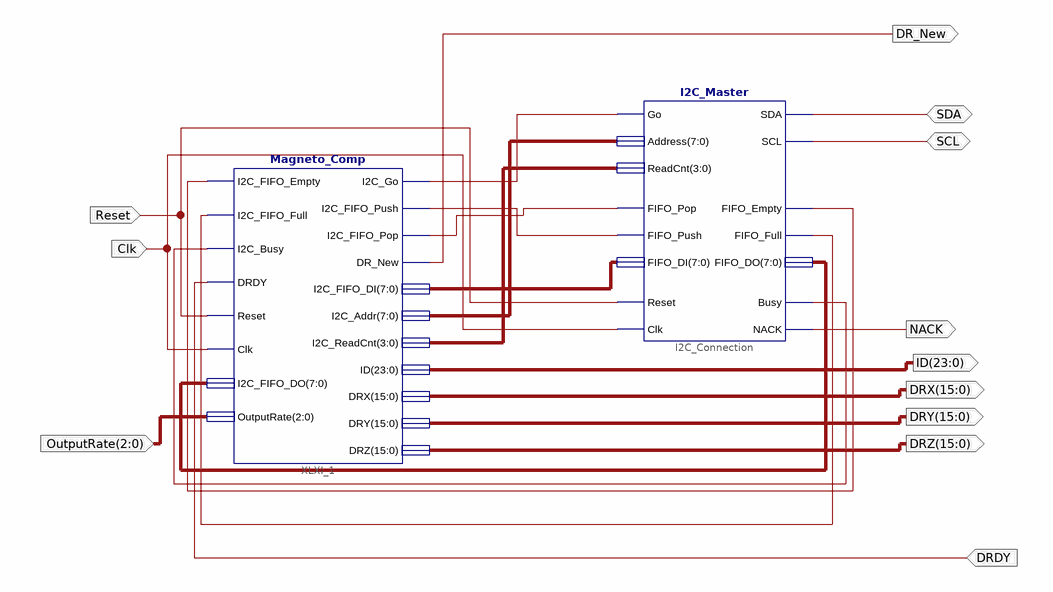
[diagram p0: schematic sheet 1]
// Xilinx ISE schematic MagnetoHMC5883L.sch (aspartan6) as structural Verilog: 2 symbols, 12 ports
module MagnetoHMC5883L (
  input  [2:0] OutputRate,
  input  Clk,
  input  DRDY,
  input  Reset,
  inout  SDA,
  inout  SCL,
  output DR_New,
  output [23:0] ID,
  output [15:0] DRX,
  output [15:0] DRY,
  output [15:0] DRZ,
  output NACK
);

  wire XLXN_4, XLXN_5, XLXN_6, XLXN_52, XLXN_54, XLXN_55;
  wire [3:0] XLXN_29;
  wire [7:0] XLXN_27, XLXN_28, XLXN_198;

  I2C_Master I2C_Connection (
    .Go(XLXN_4), .Address(XLXN_28), .ReadCnt(XLXN_29), .SDA(SDA), .SCL(SCL), .FIFO_Pop(XLXN_6),
    .FIFO_Push(XLXN_5), .FIFO_DI(XLXN_27), .FIFO_Empty(XLXN_52), .FIFO_Full(XLXN_54), .FIFO_DO(XLXN_198),
    .Reset(Reset), .Clk(Clk), .Busy(XLXN_55), .NACK(NACK));
  Magneto_Comp XLXI_1 (
    .I2C_FIFO_Empty(XLXN_52), .I2C_FIFO_Full(XLXN_54), .I2C_Busy(XLXN_55), .DRDY(DRDY), .Reset(Reset),
    .Clk(Clk), .I2C_FIFO_DO(XLXN_198), .OutputRate(OutputRate), .I2C_Go(XLXN_4), .I2C_FIFO_Push(XLXN_5),
    .I2C_FIFO_Pop(XLXN_6), .DR_New(DR_New), .I2C_FIFO_DI(XLXN_27), .I2C_Addr(XLXN_28), .I2C_ReadCnt(XLXN_29),
    .ID(ID), .DRX(DRX), .DRY(DRY), .DRZ(DRZ));
endmodule
